# EAGLE schematic VCLFO_th_2_orig (EAGLE 7.6.0)
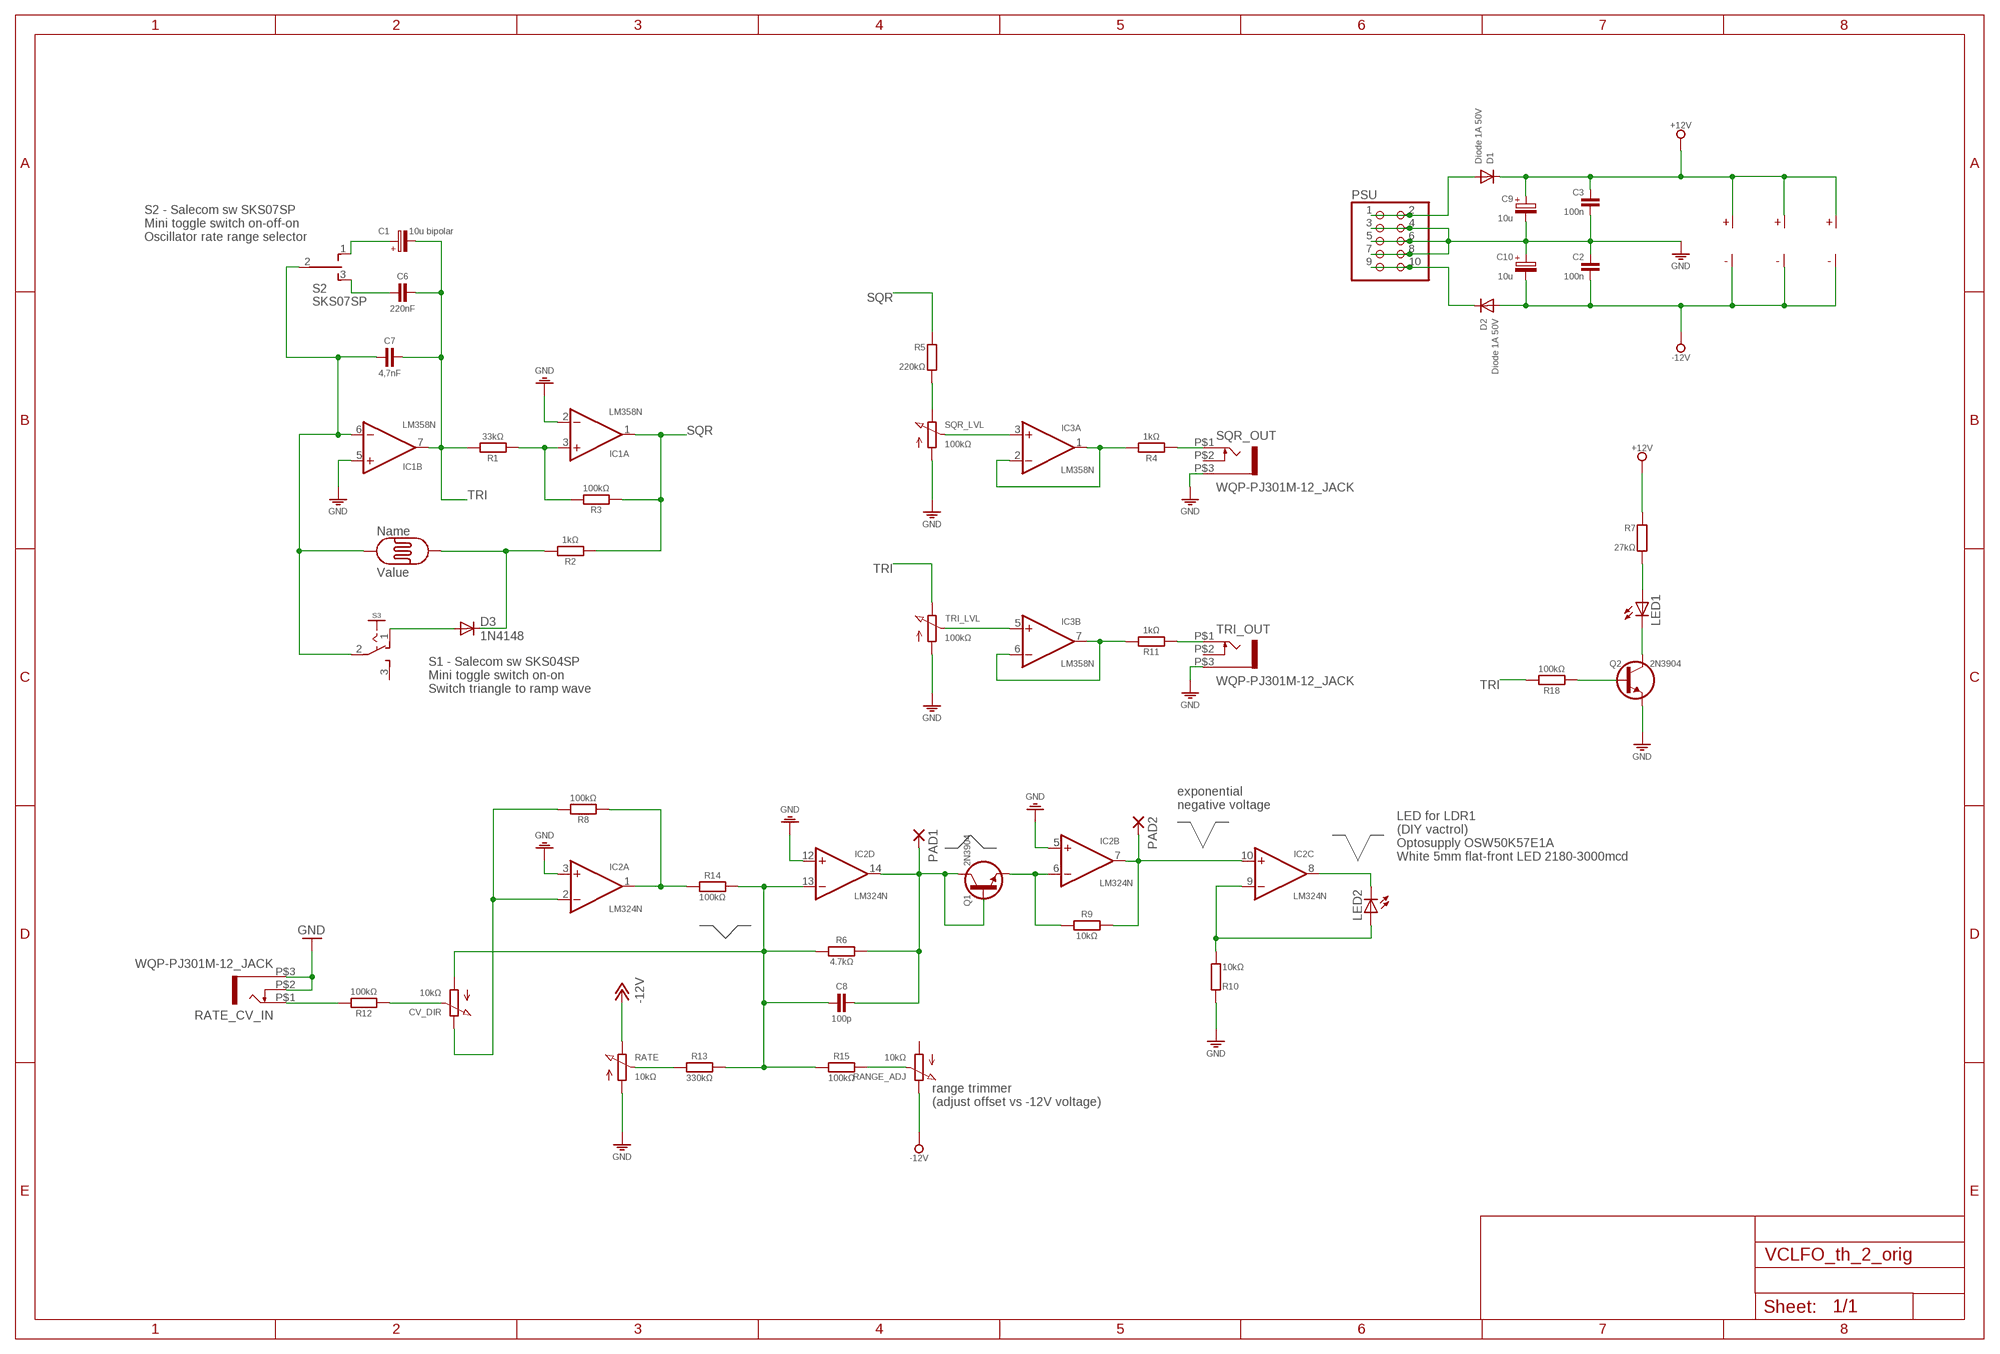
[diagram p0: schematic, sheet 1]

## Parts
C1  10u bipolar  CPOLE2,5-4  [E2,5-4]
C2  100n  C050-020X044/V  [C050-020X044/V]
C3  100n  C050-020X044/V  [C050-020X044/V]
C6  220nF  C-H050-020X044  [C050-020X044]
C7  4,7nF  C-H075-020X044  [C0750-020X044]
C8  100p  C-H025-015X024  [C025-015X024]
C9  10u  CPOLE2,5-4/V  [E2.5-4/V]
C10  10u  CPOLE2,5-4/V  [E2.5-4/V]
CV_DIR  10kΩ  POT-3P  [CONN-3P]
D1  Diode 1A 50V  1N4002-2.54  [DO35-2_54]
D2  Diode 1A 50V  1N4002-2.54A  [DO35-2_54A]
D3  1N4148  DIODE-D-5  [D-5]
IC1  LM358N  [DIL08]
IC2  LM324N  [DIL14]
IC3  LM358N  [DIL08]
LED1  LED5MM  [LED5MM]
LED2  LED5MM  [LED5MM]
PAD1  1,6/0,8  [1,6/0,8]
PAD2  1,6/0,8  [1,6/0,8]
PSU  PINHD-2X5  [2X05]
Q1  2N3904  [TO92]
Q2  2N3904  [TO92]
R1  33kΩ  R-H0204/10  [0204/10]
R2  1kΩ  R-H0204/10  [0204/10]
R3  100kΩ  R-H0204/10  [0204/10]
R4  1kΩ  R-H0204/10  [0204/10]
R5  220kΩ  R0204/10-V  [0204/10-V]
R6  4.7kΩ  R-H0204/10  [0204/10]
R7  27kΩ  R0204/10-V  [0204/10-V]
R8  100kΩ  R-H0204/10  [0204/10]
R9  10kΩ  R-H0204/10  [0204/10]
R10  10kΩ  R0204/10  [0204/10]
R11  1kΩ  R-H0204/10  [0204/10]
R12  100kΩ  R-H0204/10  [0204/10]
R13  330kΩ  R-H0204/10  [0204/10]
R14  100kΩ  R-H0204/10  [0204/10]
R15  100kΩ  R-H0204/10  [0204/10]
R17  Token PGM5539  PHOTOCELLPTH  [PHOTOCELL]
R18  100kΩ  R-H0204/10  [0204/10]
RANGE_ADJ  10kΩ  POT-3P  [CONN-3P]
RATE  10kΩ  POT-3P  [CONN-3P]
RATE_CV_IN  WQP-PJ301M-12_JACK  [WQP-PJ301M-12_JACK]
S2  SKS07SP  SL-SW-ON-OFF-ON-H  [SLSW-1P2T-H]
S3  SKS04SP  SL-SW-1P-2T-H  [SLSW-1P2T-H]
SQR_LVL  100kΩ  POT-3P  [CONN-3P]
SQR_OUT  WQP-PJ301M-12_JACK  [WQP-PJ301M-12_JACK]
TRI_LVL  100kΩ  POT-3P  [CONN-3P]
TRI_OUT  WQP-PJ301M-12_JACK  [WQP-PJ301M-12_JACK]

## Nets
+12V: C3.1 C9.+ D1.C IC1.8(P:V+) IC2.4(P:V+) IC3.8(P:V+) R7.1
-12V: C2.2 C10.- D2.A IC1.4(P:V-) IC2.11(P:V-) IC3.4(P:V-) RANGE_ADJ.3(E) RATE.3(E)
GND: C2.1 C3.2 C9.- C10.+ IC1.2(A:-IN) IC1.5(B:+IN) IC2.3(A:+IN) IC2.5(B:+IN) IC2.12(D:+IN) PSU.3 PSU.4 PSU.5 PSU.6 PSU.7 PSU.8 Q2.1(E) R10.2 RATE.1(A) RATE_CV_IN.P$2 RATE_CV_IN.P$3 SQR_LVL.1(A) SQR_OUT.P$3 TRI_LVL.1(A) TRI_OUT.P$3
N$1: C7.1 IC1.6(B:-IN) R17.1 S2.2(P) S3.2(P)
N$2: D3.C R2.2 R17.2
N$3: IC3.1(A:OUT) IC3.2(A:-IN) R4.2
N$4: R5.2 SQR_LVL.3(E)
N$5: IC1.3(A:+IN) R1.1 R3.2
N$6: R4.1 SQR_OUT.P$1
N$7: CV_DIR.3(E) IC2.2(A:-IN) R8.2
N$8: IC3.6(B:-IN) IC3.7(B:OUT) R11.2
N$9: IC3.3(A:+IN) SQR_LVL.2(S)
N$10: D1.A PSU.1 PSU.2
N$11: D2.C PSU.9 PSU.10
N$12: R12.2 RATE_CV_IN.P$1
N$13: C8.2 IC2.14(D:OUT) PAD1.1(P) Q1.2(B) Q1.3(C) R6.2
N$14: C1.+ S2.1(O)
N$15: CV_DIR.2(S) R12.1
N$16: D3.A S3.1(O)
N$17: R11.1 TRI_OUT.P$1
N$18: R13.1 RATE.2(S)
N$19: C6.1 S2.3(S)
N$20: Q2.2(B) R18.1
N$21: IC2.6(B:-IN) Q1.1(E) R9.1
N$22: IC2.1(A:OUT) R8.1 R14.1
N$23: C8.1 CV_DIR.1(A) IC2.13(D:-IN) R6.1 R13.2 R14.2 R15.1
N$24: IC2.7(B:OUT) IC2.10(C:+IN) PAD2.1(P) R9.2
N$25: R15.2 RANGE_ADJ.2(S)
N$26: IC2.8(C:OUT) LED2.K(C)
N$27: IC2.9(C:-IN) LED2.A R10.1
N$28: IC3.5(B:+IN) TRI_LVL.2(S)
N$30: LED1.K(C) Q2.3(C)
N$31: LED1.A R7.2
SQR: IC1.1(A:OUT) R2.1 R3.1 R5.1
TRI: C1.- C6.2 C7.2 IC1.7(B:OUT) R1.2 R18.2 TRI_LVL.3(E)
Unconnected: RANGE_ADJ.1(A) S3.3(S) SQR_OUT.P$2 TRI_OUT.P$2

## Notes on the sheet
- S2 - Salecom sw SKS07SP
  Mini toggle switch on-off-on
  Oscillator rate range selector
- S1 - Salecom sw SKS04SP
  Mini toggle switch on-on
  Switch triangle to ramp wave
- exponential
  negative voltage
- LED for LDR1
  (DIY vactrol)
  Optosupply OSW50K57E1A
  White 5mm flat-front LED 2180-3000mcd
- range trimmer
  (adjust offset vs -12V voltage)

## Library data of the parts
C1 C9 C10 = c:CPOL: POLARIZED CAPACITOR, European symbol
C2 C3 = c:C: CAPACITOR, European symbol
C6-C8 = c:C-H
CV_DIR RANGE_ADJ RATE SQR_LVL TRI_LVL = r:POT
D1 D2 = d:1N4002
D3 = diode:DIODE-: DIODE
IC1 IC3 = ic:LM358: OP AMP also LM158; LM258; LM2904 Source: http://cache.national.com/ds/LM/LM158.pdf
IC2 = ic:LM324: OP AMP
LED1 LED2 = led:LED: LED OSRAM: - CHIPLED LG R971, LG N971, LY N971, LG Q971, LY Q971, LO R971, LY R971 LH N974, LH R974 LS Q976, LO Q976, LY Q976 LO Q996 - Hyper CHIPLED LW Q18S LB Q993, LB Q99A, LB R99A - SideLED LS A670, LO A670, LY A670, LG A670, LP A670 LB A673, LV A673, LT A673, LW A673 LH A674 LY A675 LS A676, LA A676, LO A676, LY A676, LW A676 LS A679, LY A679, LG A679 - Hyper Micro SIDELED@@ LS Y876, LA Y876, LO Y876, LY Y876 LT Y87S - SmartLED LW L88C, LW L88S LB L89C, LB L89S, LG L890 LS L89K, LO L89K, LY L89K LS L896, LA L896, LO L896, LY L896 - TOPLED LS T670, LO T670, LY T670, LG T670, LP T670 LSG T670, LSP T670, LSY T670, LOP T670, LYG T670 LG T671, LOG T671, LSG T671 LB T673, LV T673, LT T673, LW T673 LH T674 LS T676, LA T676, LO T676, LY T676, LB T676, LH T676, LSB T676, LW T676 LB T67C, LV T67C, LT T67C, LS T67K, LO T67K, LY T67K, LW E67C LS E67B, LA E67B, LO E67B, LY E67B, LB E67C, LV E67C, LT E67C LW T67C LS T679, LY T679, LG T679 LS T770, LO T770, LY T770, LG T770, LP T770 LB T773, LV T773, LT T773, LW T773 LH T774 LS E675, LA E675, LY E675, LS T675 LS T776, LA T776, LO T776, LY T776, LB T776 LHGB T686 LT T68C, LB T68C - Hyper Mini TOPLED@@ LB M676 - Mini TOPLED Santana@@ LG M470 LS M47K, LO M47K, LY M47K Source: http://www.osram.convergy.de LUXEON: - LUMILED@@ LXK2-PW12-R00, LXK2-PW12-S00, LXK2-PW14-U00, LXK2-PW14-V00 LXK2-PM12-R00, LXK2-PM12-S00, LXK2-PM14-U00 LXK2-PE12-Q00, LXK2-PE12-R00, LXK2-PE12-S00, LXK2-PE14-T00, LXK2-PE14-U00 LXK2-PB12-K00, LXK2-PB12-L00, LXK2-PB12-M00, LXK2-PB14-N00, LXK2-PB14-P00, LXK2-PB14-Q00 LXK2-PR12-L00, LXK2-PR12-M00, LXK2-PR14-Q00, LXK2-PR14-R00 LXK2-PD12-Q00, LXK2-PD12-R00, LXK2-PD12-S00 LXK2-PH12-R00, LXK2-PH12-S00 LXK2-PL12-P00, LXK2-PL12-Q00, LXK2-PL12-R00 Source: www.luxeon.com KINGBRIGHT: KA-3528ASYC Source: www.kingbright.com
PAD1 PAD2 = wirepad:1,6/0,8: THROUGH-HOLE PAD
PSU = pinhead:PINHD-2X5: PIN HEADER
Q1 Q2 = t:2N3904
R1-R4 R6 R8 R9 R11-R15 R18 = r:R-H
R5 R7 R10 = r:R: RESISTOR, European symbol
R17 = SparkFun-Sensors:PHOTOCELL: CdS photoresistor. This is a low cost way to detect light levels. Resistance decreases with more incoming light. SparkFun SKU: SEN-09088
RATE_CV_IN SQR_OUT TRI_OUT = thonkiconn:WQP-PJ301M-12_JACK
S2 = sw:SL-SW-ON-OFF-ON
S3 = sw:SL-SW-1P-2T